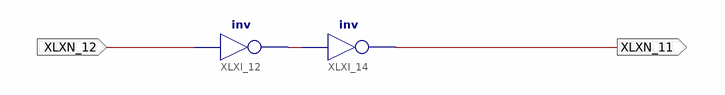
[diagram p0: schematic sheet 1]
// Xilinx ISE schematic output_high.sch (xc9500xl) as structural Verilog: 2 symbols, 2 ports
module output_high (
  input  XLXN_12,
  output XLXN_11
);

  wire XLXN_19;

  not XLXI_12 (XLXN_19, XLXN_12);
  not XLXI_14 (XLXN_11, XLXN_19);
endmodule
